# EAGLE design control (EAGLE 6.5.0)
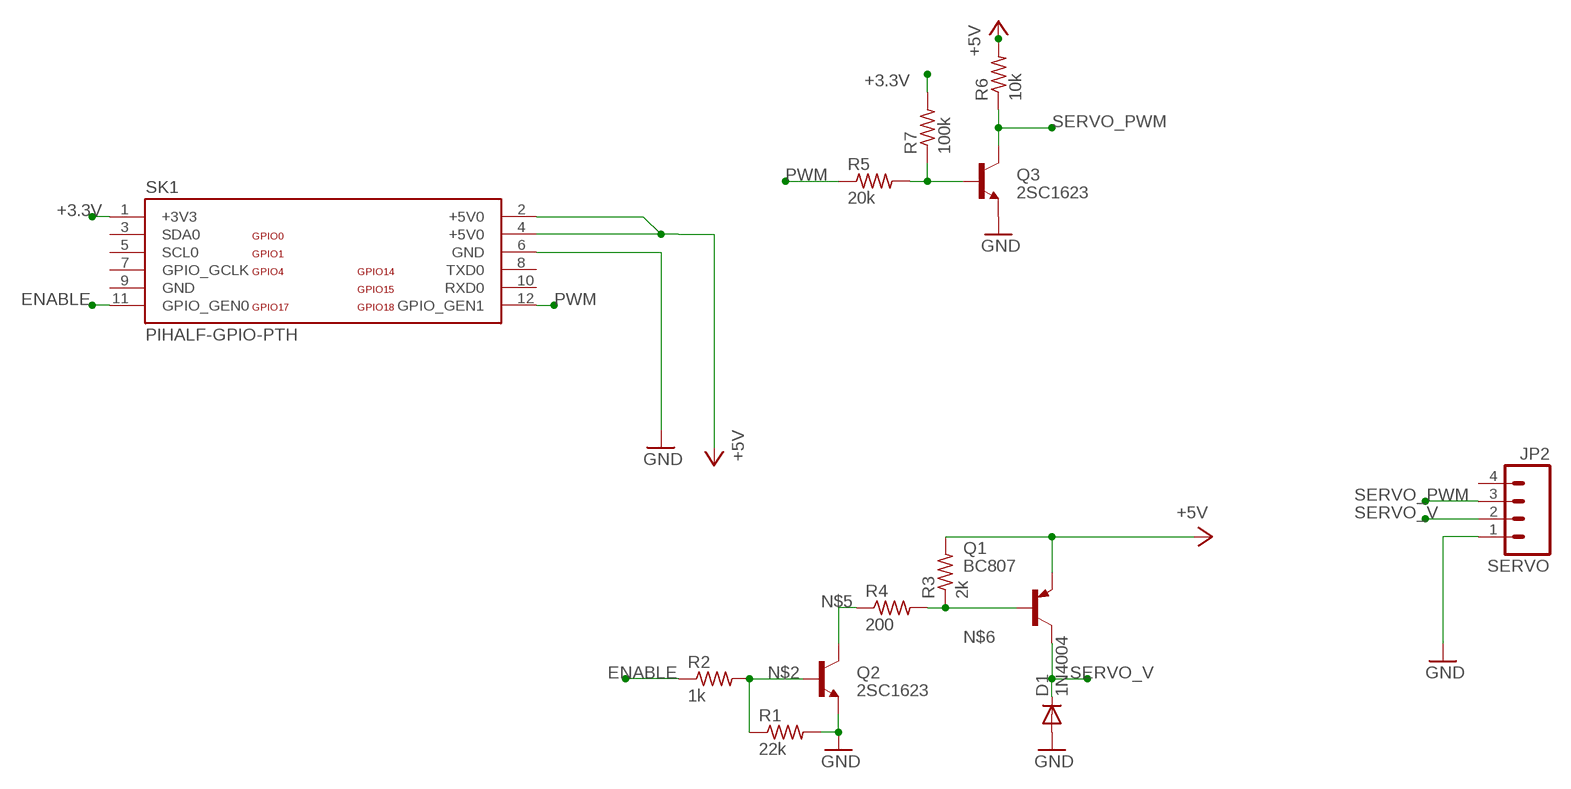
[diagram p0: schematic, sheet 1]

## Parts
D1  1N4004  DIODESOD  [SOD-323]
JP2  SERVO  M04SMD  [1X04-SMD]
Q1  BC807  -PNP-SOT23-BCE  [SOT23-BCE]
Q2  2SC1623  TRANSISTOR_NPNSOT23  [SOT23]
Q3  2SC1623  TRANSISTOR_NPNSOT23  [SOT23]
R1  22k  R-US_M0805  [M0805]
R2  1k  R-US_M0805  [M0805]
R3  2k  R-US_M0805  [M0805]
R4  200  R-US_M0805  [M0805]
R5  20k  R-US_M0805  [M0805]
R6  10k  R-US_M0805  [M0805]
R7  100k  R-US_M0805  [M0805]
SK1  PIHALF-GPIO-PTH  [GPIO-CONNECTOR-HALF]

## Nets
+3.3V: R7.2 SK1.1(+3V3)
+5V: Q1.E R3.2 R6.2 SK1.2(+5V0) SK1.4(+5V0)
ENABLE: R2.1 SK1.11(GPIO_GEN0)
GND: D1.2(A) JP2.1 Q2.2(E) Q3.2(E) R1.2 SK1.6(GND)
N$1: Q3.1(B) R5.2 R7.1
N$2: Q2.1(B) R1.1 R2.2
N$5: Q2.3(C) R4.1
N$6: Q1.B R3.1 R4.2
PWM: R5.1 SK1.12(GPIO_GEN1)
SERVO_PWM: JP2.3 Q3.3(C) R6.1
SERVO_V: D1.1(C) JP2.2 Q1.C
Unconnected: JP2.4 SK1.3(SDA0) SK1.5(SCL0) SK1.7(GPIO_GCLK) SK1.8(TXD0) SK1.10(RXD0)

## Power pins joined to a net without a drawn wire
GND: SK1.9(GND)

## Library data of the parts
D1 = SparkFun:DIODE: Diode These are standard reverse protection diodes and small signal diodes. SMA package can handle up to about 1A. SOD-323 can handle about 200mA. What the SOD-323 package when ordering, there are some mfgs out there that are 5-pin packages.
JP2 = SparkFun:M04: Header 4 Standard 4-pin 0.1" header. Use with straight break away headers (SKU : PRT-00116), right angle break away headers (PRT-00553), swiss pins (PRT-00743), machine pins (PRT-00117), and female headers (PRT-00115). Molex polarized connector foot print use with SKU : PRT-08231 with associated crimp pins and housings. 1MM SMD Version SKU: PRT-10208
Q1 = transistor:*-PNP-: PNP Transistror
Q2 Q3 = SparkFun:TRANSISTOR_NPN: Transistor NPN BJT configuration in SOT23 package. MMBT2222 is the common NPN we use. Double check BCE configuration again layout.
R1-R7 = adafruit:R-US_: RESISTOR, American symbol
SK1 = flux:PIHALF-

## Board
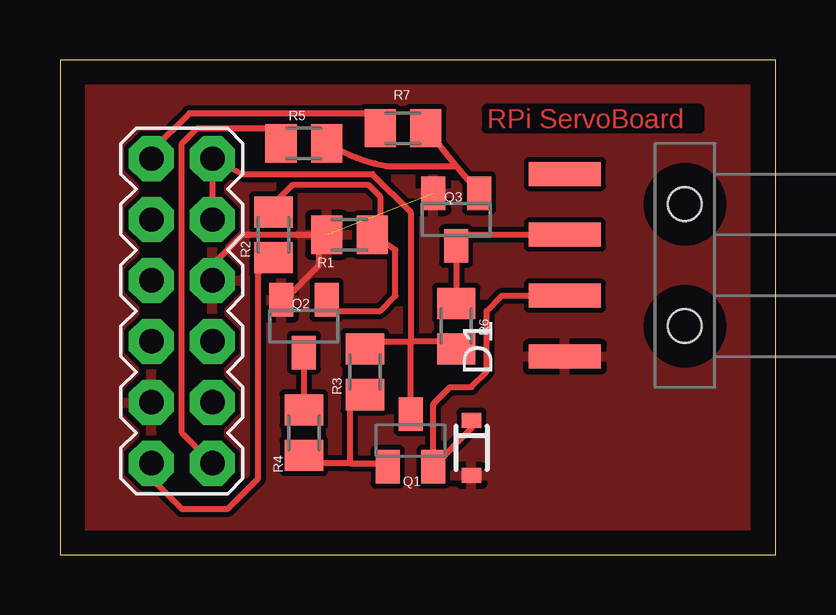
[diagram p1: board, top side]

Size 29.82 x 20.62 mm. Coordinates in mm from the lower left corner, seen from the top.
Outline: 0,0 29.82,0 29.82,20.62 0,20.62 0,0
Copper layers (1*16): Top 0.035mm / dielectric 1.5mm / Bottom 0.035mm
Design rules "kotipcb": minimum track width 10mil, minimum drill 24mil, track to track 8mil, track to pad 8mil, pad to pad 8mil, via to via 8mil, smd to smd 8mil, copper to edge 40mil, drill to drill 8mil, minimum pad ring 17mil, minimum via ring 8mil, stop-mask expansion 4mil, vias tented up to drill 0mil, thermal gap 10mil

### Footprints (pad centres in the part's own frame; a part is rotated, then mirrored left to right if it is on the bottom)
SOD-323 = smd 0.63 x 0.83: 1 -1.15,0; 2 1.15,0
1X04-SMD = smd 1 x 3: 1 -3.81,5; 2 -1.27,5; 3 1.27,5; 4 3.81,5 | hole 1.4: -2.54,0; 2.54,0
SOT23-BCE = smd 1 x 1.4: B -0.95,-1.1; C 0.95,-1.1; E 0,1.1
SOT23 = smd 1 x 1.4: 1 -0.95,-1.1; 2 0.95,-1.1; 3 0,1.1
M0805 = smd 1.3 x 1.6: 1 -0.95,0; 2 0.95,0
GPIO-CONNECTOR-HALF = drill 1.016 pad 1.676 octagon: 1 -6.35,-1.27; 2 -6.35,1.27; 3 -3.81,-1.27; 4 -3.81,1.27; 5 -1.27,-1.27; 6 -1.27,1.27; 7 1.27,-1.27; 8 1.27,1.27; 9 3.81,-1.27; 10 3.81,1.27; 11 6.35,-1.27; 12 6.35,1.27

### Placement (x,y rotation side)
D1  17.14,4.45 270 top
JP2  26.04,12.06 90 top
Q1  14.61,4.76 0 top
Q2  10.16,9.53 180 top
Q3  16.51,13.97 180 top
R1  12.06,13.34 180 top
R2  8.89,13.34 90 top
R3  12.7,7.62 90 top
R4  10.16,5.08 270 top
R5  10.16,17.14 0 top
R6  16.51,9.53 270 top
R7  14.29,17.78 180 top
SK1  5.08,10.16 270 top

### Tracks (layer width: path | path; a pad name or v marks a point on that pad's centre or on a via)
+3.3V
  Top 0.258: SK1.1 3.81,16.83 5.4,18.41 12.7,18.41 R7.2
+5V
  Top 0.254: 14.61,8.89 16.51,8.89 R6.2 | SK1.4 SK1.2 7.62,15.88 13.02,15.88 14.61,14.29 14.61,8.89 | R3.2 13.02,8.89 14.61,8.89 | Q1.E 14.61,8.89
ENABLE
  Top 0.254: SK1.11 3.81,3.17 5.08,1.91 6.99,1.91 8.26,3.17 8.26,11.75 R2.1
GND  (1 unrouted)
  Top 0.254: SK1.6 6.35,12.06 7.62,13.34 10.16,13.34 R1.2 10.79,13.02 10.79,12.06 9.36,10.62 Q2.2
  pour Top: 0.64,0.64 28.57,0.64 28.57,19.68 0.64,19.68
N$1
  Top 0.254: 17.78,15.24 Q3.1 16.51,16.19 13.65,16.19 arc-21 R5.2
  Top 0.258: 16.51,16.19 R7.1
N$2
  Top 0.254: Q2.1 11.43,10.16 13.34,10.16 13.97,10.79 13.97,12.7 R1.1 13.34,13.65 13.34,14.92 12.84,15.42 9.71,15.42 8.89,14.61 R2.2
N$5
  Top 0.254: Q2.3 10.16,8.89 Q2.3 | Q2.3 10.16,6.35 R4.1
N$6
  Top 0.254: 12.06,3.81 10.16,3.81 R4.2 | R3.1 12.06,6.03 12.06,3.81 | 12.06,3.81 13.65,3.81 Q1.B
  Top 0.305: R3.1
PWM
  Top 0.254: SK1.12 5.08,5.08 5.08,17.14 5.71,17.78 7.62,17.78 8.89,17.78 R5.1
SERVO_PWM
  Top 0.254: R6.1 16.51,10.16 R6.1 | R6.1 Q3.3 16.51,13.34 JP2.3
SERVO_V
  Top 0.254: Q1.C 15.55,6.27 16.27,6.99 17.14,6.99 17.78,7.62 17.78,10.16 18.41,10.79 19.68,10.79 JP2.2
  Top 0.258: JP2.2 21.59,10.79 | D1.1 17.14,5.25 Q1.C

### Text on the board
Top: RPi ServoBoard